# EasyEDA Pro project MAX5864_REUSE.eprj, schematic Schematic3
Create Date: 2024-11-02; Page Name: P1; Project Name: MAX5864_REUSE; Schematic Name: Schematic3; Update Date: 2024-11-02; Company: EasyEDA.com; Drawn: EasyEDA; Page Size: A4; Part Number: JLCPCB-002; Reviewed: EasyEDA; Version: V0.1
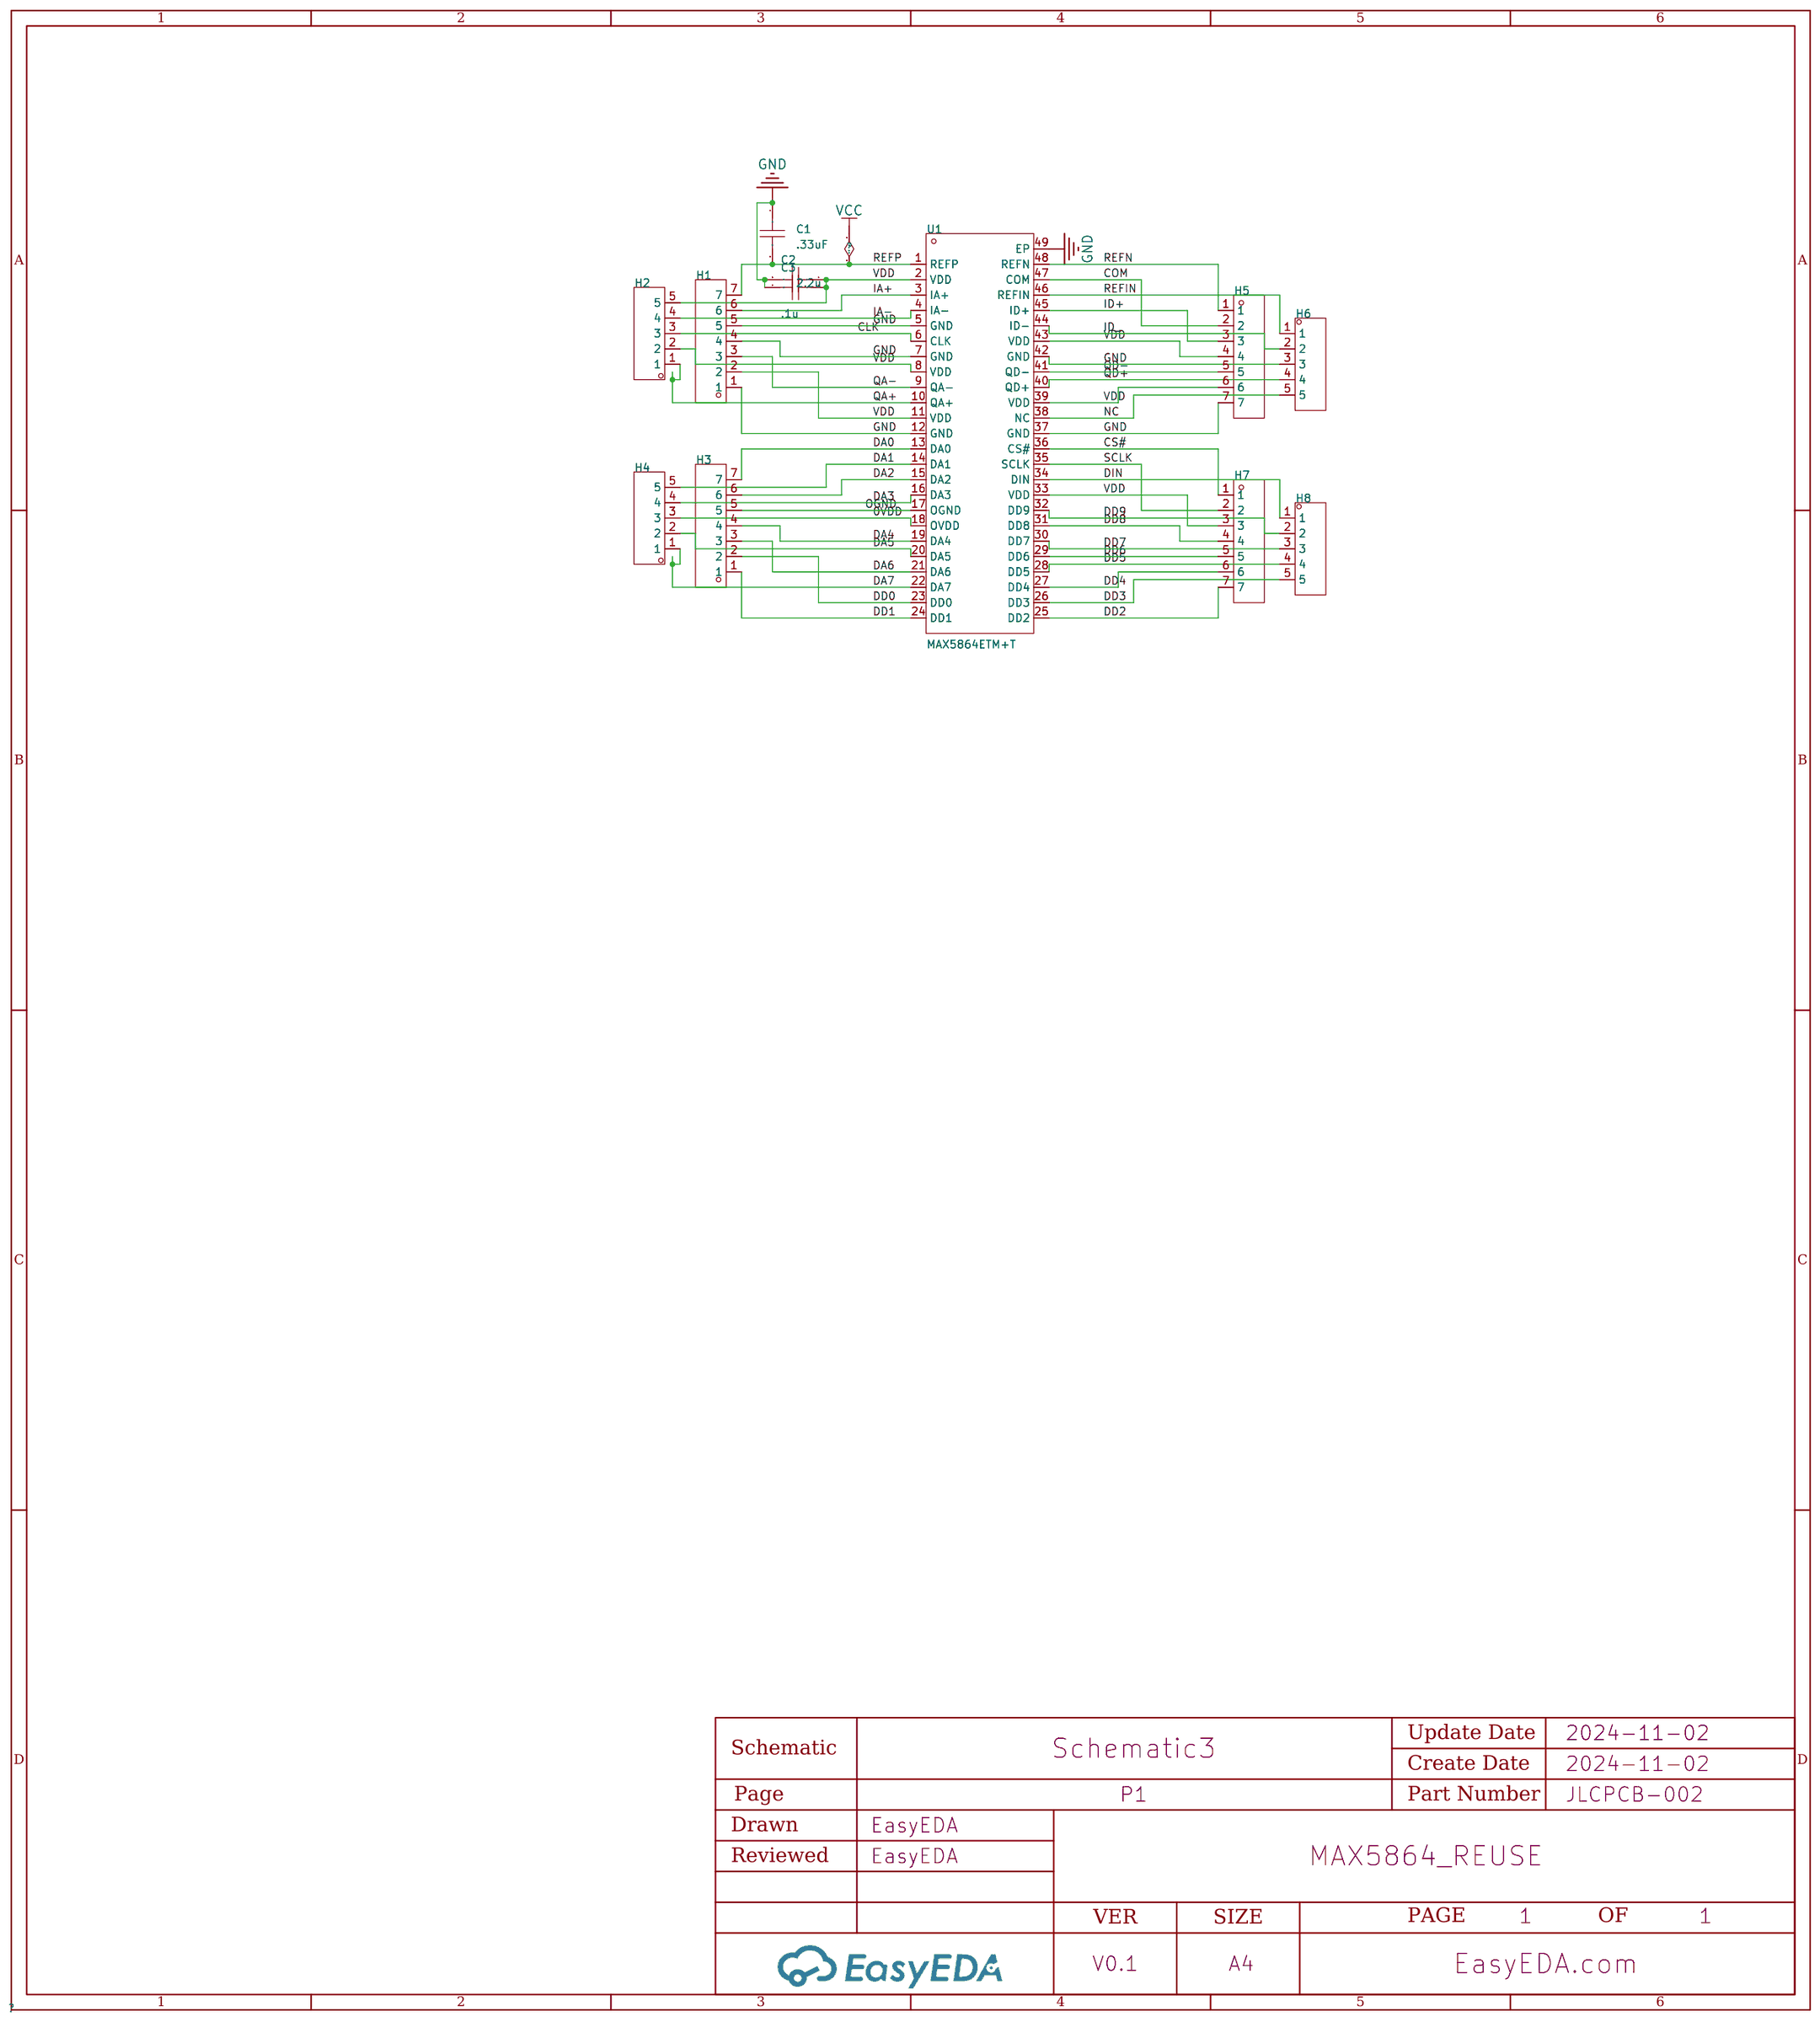
[diagram p2: schematic sheet]

## Parts
C1  .33uF  [C0805]
C2  2.2u  [C0805]
C3  .1u  [C0805]
H1  -  [HDR-TH_7P-P2.54-V-M]
H2  -  [HDR-TH_5P-P2.54-V-M]
H3  -  [HDR-TH_7P-P2.54-V-M]
H4  -  [HDR-TH_5P-P2.54-V-M]
H5  -  [HDR-TH_7P-P2.54-V-M]
H6  -  [HDR-TH_5P-P2.54-V-M]
H7  -  [HDR-TH_7P-P2.54-V-M]
H8  -  [HDR-TH_5P-P2.54-V-M]
U1  MAX5864ETM+T  [QFN-48_L7.0-W7.0-P0.50-BL-EP5.6]

## Library data of the parts
C1-C3 = CAP_0805: Supplier Footprint: 0805
H1 H3 H5 H7 = HDR-M_2.54_1x7P: Supplier Footprint: Through
H2 H4 H6 H8 = HDR-M_2.54_1x5P: Supplier Footprint: Through
U1 = MAX5864ETM+T: Supply Voltage:2.7V~3.3V Supply Voltage:2.7V~3.3V; LCSC Part Name: 超低功耗、高动态性能、22Msps模拟前端; Supplier Part: C2651650; Manufacturer: ADI(亚德诺)/MAXIM(美信); Supplier Footprint: QFN-48-EP(7x7); JLCPCB Part Class: Extended Part; Datasheet: https://atta.szlcsc.com/upload/public/pdf/source/20171204/C143525_15123772477351162683.pdf; Supplier: LCSC; Supply Voltage: 2.7V~3.3V

## Nets
0VDD: H4.3 U1.18(OVDD)
GND: C1.1 C2.2 C3.2 H1.1 H1.4 H1.5 H5.7 H6.3 U1.5(GND) U1.7(GND) U1.12(GND) U1.37(GND) U1.42(GND) U1.49(EP)
VCC: C1.2 H1.7 U1.1(REFP)
VDD: C2.1 C3.1 H1.2 H2.2 H2.5 H5.4 H5.6 H7.3 U1.2(VDD) U1.8(VDD) U1.11(VDD) U1.33(VDD) U1.39(VDD) U1.43(VDD)
CLK: H2.3 U1.6(CLK)
COM: H5.2 U1.47(COM)
CS#: H7.1 U1.36(CS#)
DA0: H3.7 U1.13(DA0)
DA1: H4.5 U1.14(DA1)
DA2: H3.6 U1.15(DA2)
DA3: H4.4 U1.16(DA3)
DA4: H3.4 U1.19(DA4)
DA5: H4.2 U1.20(DA5)
DA6: H3.3 U1.21(DA6)
DA7: H4.1 U1.22(DA7)
DD0: H3.2 U1.23(DD0)
DD1: H3.1 U1.24(DD1)
DD2: H7.7 U1.25(DD2)
DD3: H8.5 U1.26(DD3)
DD4: H7.6 U1.27(DD4)
DD5: H8.4 U1.28(DD5)
DD6: H7.5 U1.29(DD6)
DD7: H8.3 U1.30(DD7)
DD8: H7.4 U1.31(DD8)
DD9: H8.2 U1.32(DD9)
DIN: H8.1 U1.34(DIN)
IA+: H1.6 U1.3(IA+)
IA-: H2.4 U1.4(IA-)
ID+: H5.3 U1.45(ID+)
ID_: H6.2 U1.44(ID-)
NC: H6.5 U1.38(NC)
OGND: H3.5 U1.17(OGND)
QA+: H2.1 U1.10(QA+)
QA-: H1.3 U1.9(QA-)
QD+: H6.4 U1.40(QD+)
QD-: H5.5 U1.41(QD-)
REFIN: H6.1 U1.46(REFIN)
REFN: H5.1 U1.48(REFN)
SCLK: H7.2 U1.35(SCLK)
